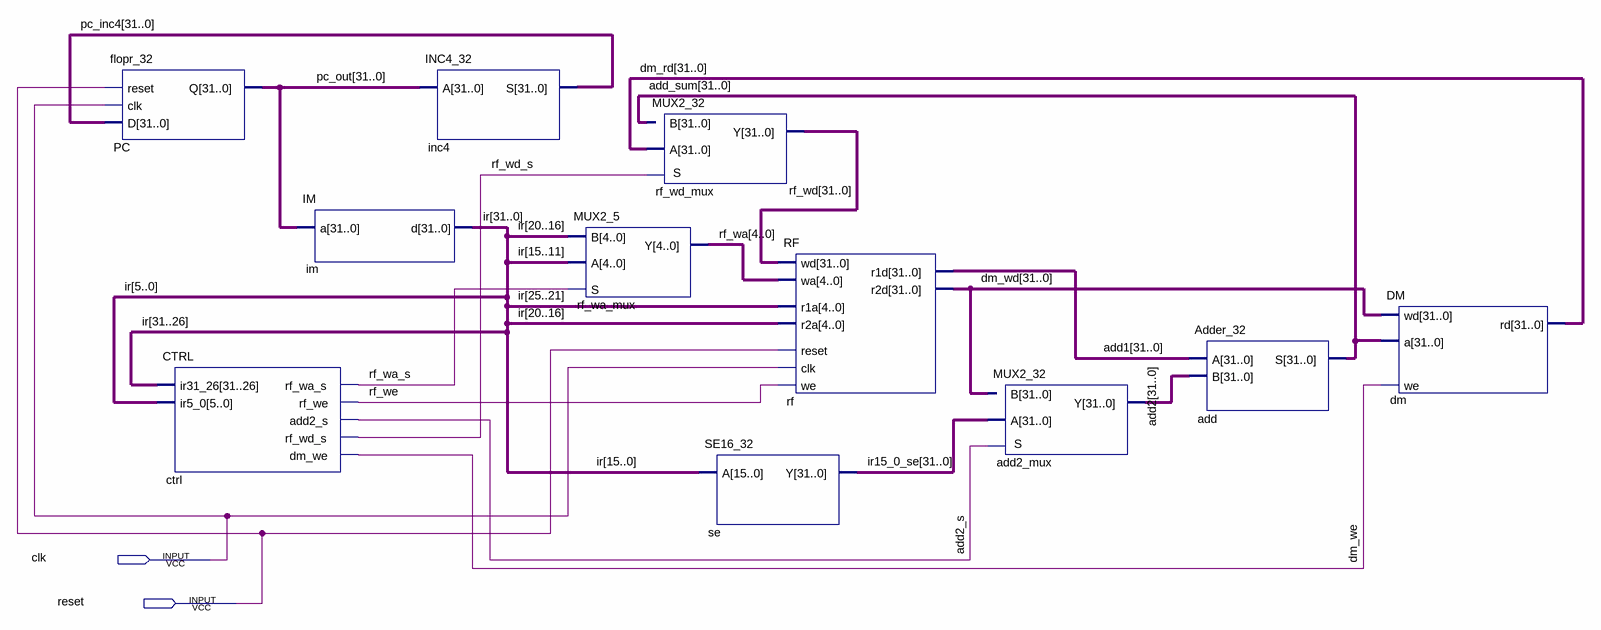
[diagram p0: schematic sheet]
// Quartus schematic CPU.bdf as structural Verilog: 11 symbols, 2 pins
module CPU (
  input  clk,
  input  reset
);

  wire add2_s, dm_we, rf_wa_s, rf_wd_s, rf_we;
  wire [4:0] rf_wa;
  wire [31:0] add1, add2, add_sum, dm_rd, dm_wd, ir, ir15_0_se, pc_inc4, pc_out, rf_wd;

  flopr_32 PC (.reset(reset), .clk(clk), .D(pc_inc4), .Q(pc_out));
  CTRL ctrl (
    .ir31_26(ir[31:26]), .ir5_0(ir[5:0]), .rf_wa_s(rf_wa_s), .rf_we(rf_we), .add2_s(add2_s),
    .rf_wd_s(rf_wd_s), .dm_we(dm_we));
  IM im (.a(pc_out), .d(ir));
  INC4_32 inc4 (.A(pc_out), .S(pc_inc4));
  MUX2_5 rf_wa_mux (.S(rf_wa_s), .A(ir[15:11]), .B(ir[20:16]), .Y(rf_wa));
  MUX2_32 rf_wd_mux (.B(add_sum), .S(rf_wd_s), .A(dm_rd), .Y(rf_wd));
  SE16_32 se (.A(ir[15:0]), .Y(ir15_0_se));
  RF rf (
    .r1a(ir[25:21]), .r2a(ir[20:16]), .reset(reset), .clk(clk), .wd(rf_wd), .we(rf_we), .wa(rf_wa),
    .r1d(add1), .r2d(dm_wd));
  MUX2_32 add2_mux (.B(dm_wd), .S(add2_s), .A(ir15_0_se), .Y(add2));
  Adder_32 add (.A(add1), .B(add2), .S(add_sum));
  DM dm (.a(add_sum), .wd(dm_wd), .we(dm_we), .rd(dm_rd));
endmodule
